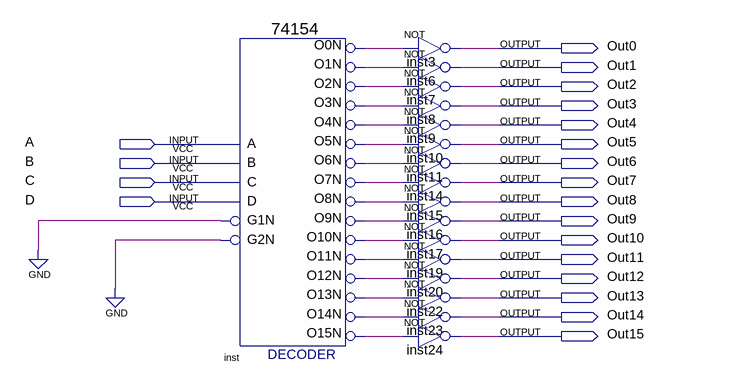
[diagram p0: schematic sheet]
// Quartus schematic ID.bdf as structural Verilog: 17 symbols, 20 pins
module ID (
  input  A,
  input  B,
  input  C,
  input  D,
  output Out0,
  output Out1,
  output Out2,
  output Out3,
  output Out4,
  output Out5,
  output Out6,
  output Out7,
  output Out8,
  output Out9,
  output Out10,
  output Out11,
  output Out12,
  output Out13,
  output Out14,
  output Out15
);

  wire inst_o0n, inst_o1n, inst_o2n, inst_o3n, inst_o4n, inst_o5n, inst_o6n, inst_o7n, inst_o8n, inst_o9n,
       inst_o10n, inst_o11n, inst_o12n, inst_o13n, inst_o14n, inst_o15n;

  \74154  inst (
    .C(C), .D(D), .B(B), .A(A), .G1N(1'b0), .G2N(1'b0), .O0N(inst_o0n), .O12N(inst_o12n), .O15N(inst_o15n),
    .O10N(inst_o10n), .O11N(inst_o11n), .O1N(inst_o1n), .O13N(inst_o13n), .O14N(inst_o14n), .O4N(inst_o4n),
    .O3N(inst_o3n), .O2N(inst_o2n), .O7N(inst_o7n), .O6N(inst_o6n), .O5N(inst_o5n), .O9N(inst_o9n),
    .O8N(inst_o8n));
  not inst3 (Out0, inst_o0n);
  not inst6 (Out1, inst_o1n);
  not inst7 (Out2, inst_o2n);
  not inst8 (Out3, inst_o3n);
  not inst9 (Out4, inst_o4n);
  not inst10 (Out5, inst_o5n);
  not inst11 (Out6, inst_o6n);
  not inst14 (Out7, inst_o7n);
  not inst15 (Out8, inst_o8n);
  not inst16 (Out9, inst_o9n);
  not inst17 (Out10, inst_o10n);
  not inst19 (Out11, inst_o11n);
  not inst20 (Out12, inst_o12n);
  not inst22 (Out13, inst_o13n);
  not inst23 (Out14, inst_o14n);
  not inst24 (Out15, inst_o15n);
endmodule
